# EAGLE schematic DIDV_Full (EAGLE 6.2)

## Sheet 1 of 4
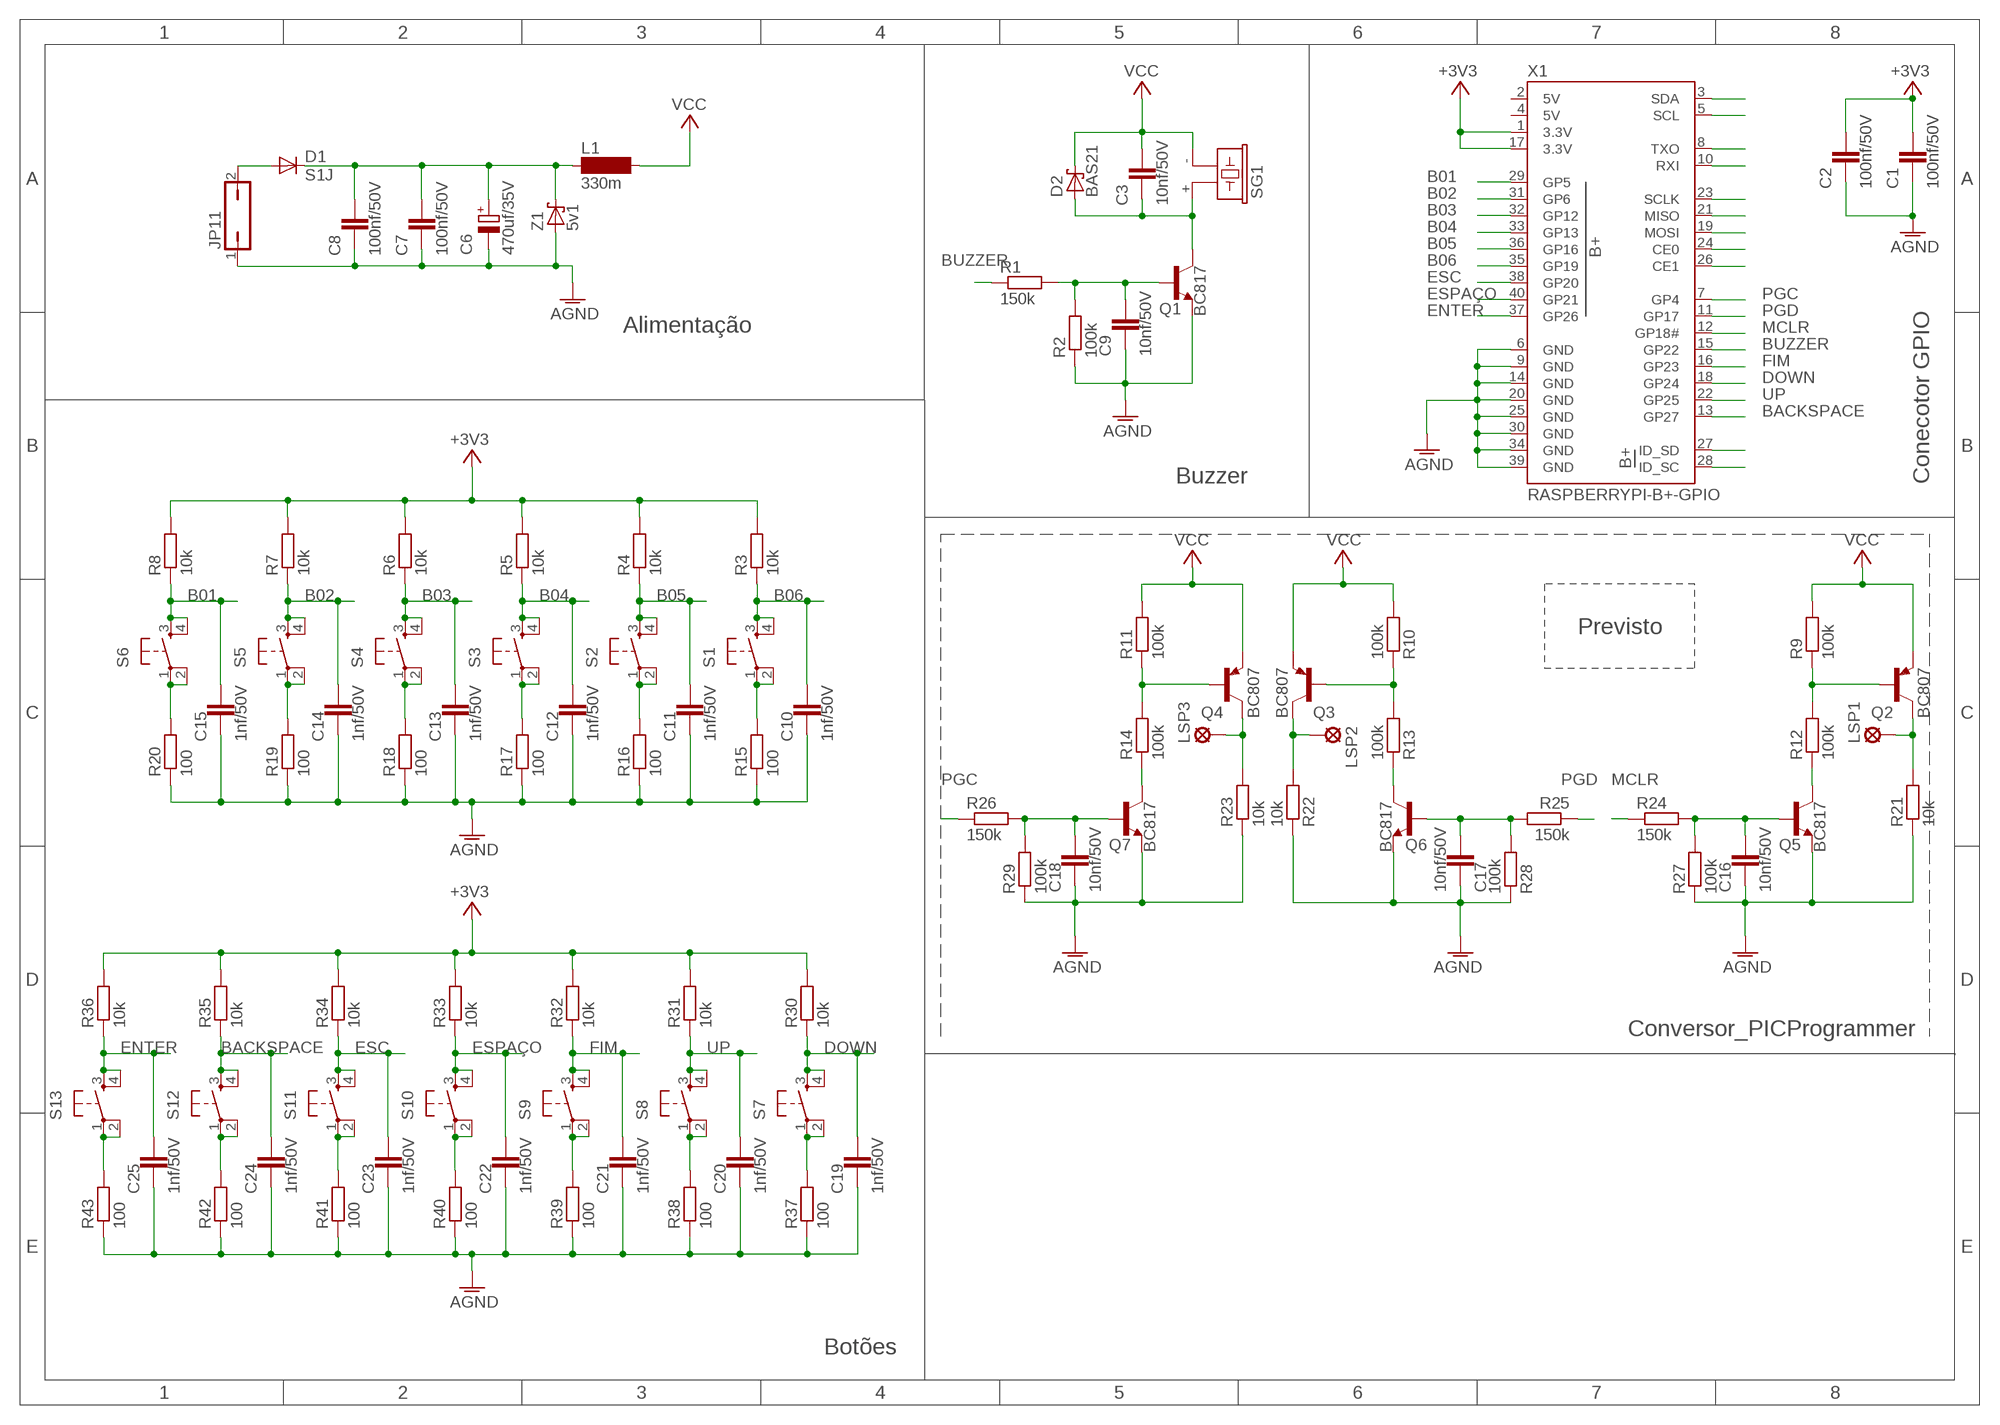
[diagram p0: schematic, sheet 1]

### Parts
C1  100nf/50V  C-EUC0603K  [C0603K]
C2  100nf/50V  C-EUC0603K  [C0603K]
C3  10nf/50V  C-EUC0603K  [C0603K]
C6  470uf/35V  CPOL-EU140CLH-1014  [140CLH-1014]
C7  100nf/50V  C-EUC0805  [C0805]
C8  100nf/50V  C-EUC0805  [C0805]
C9  10nf/50V  C-EUC0603K  [C0603K]
C10  1nf/50V  C-EUC0603K  [C0603K]
C11  1nf/50V  C-EUC0603K  [C0603K]
C12  1nf/50V  C-EUC0603K  [C0603K]
C13  1nf/50V  C-EUC0603K  [C0603K]
C14  1nf/50V  C-EUC0603K  [C0603K]
C15  1nf/50V  C-EUC0603K  [C0603K]
C16  10nf/50V  C-EUC0603K  [C0603K]
C17  10nf/50V  C-EUC0603K  [C0603K]
C18  10nf/50V  C-EUC0603K  [C0603K]
C19  1nf/50V  C-EUC0603K  [C0603K]
C20  1nf/50V  C-EUC0603K  [C0603K]
C21  1nf/50V  C-EUC0603K  [C0603K]
C22  1nf/50V  C-EUC0603K  [C0603K]
C23  1nf/50V  C-EUC0603K  [C0603K]
C24  1nf/50V  C-EUC0603K  [C0603K]
C25  1nf/50V  C-EUC0603K  [C0603K]
D1  S1J  DIODE-SMC  [SMC]
D2  BAS21  BAS40  [SOT23]
JP11  JP1Q  [JP1]
L1  330m  MS50  [MS50]
LSP1  LSP10  [LSP10]
LSP2  LSP10  [LSP10]
LSP3  LSP10  [LSP10]
Q1  BC817  BC817-16LT1SMD  [SOT23-BEC]
Q2  BC807  BC807-40SMD  [SOT23-BEC]
Q3  BC807  BC807-40SMD  [SOT23-BEC]
Q4  BC807  BC807-40SMD  [SOT23-BEC]
Q5  BC817  BC817-16LT1SMD  [SOT23-BEC]
Q6  BC817  BC817-16LT1SMD  [SOT23-BEC]
Q7  BC817  BC817-16LT1SMD  [SOT23-BEC]
R1  150k  R-EU_R0603  [R0603]
R2  100k  R-EU_R0603  [R0603]
R3  10k  R-EU_R0603  [R0603]
R4  10k  R-EU_R0603  [R0603]
R5  10k  R-EU_R0603  [R0603]
R6  10k  R-EU_R0603  [R0603]
R7  10k  R-EU_R0603  [R0603]
R8  10k  R-EU_R0603  [R0603]
R9  100k  R-EU_R0603  [R0603]
R10  100k  R-EU_R0603  [R0603]
R11  100k  R-EU_R0603  [R0603]
R12  100k  R-EU_R0603  [R0603]
R13  100k  R-EU_R0603  [R0603]
R14  100k  R-EU_R0603  [R0603]
R15  100  R-EU_R0603  [R0603]
R16  100  R-EU_R0603  [R0603]
R17  100  R-EU_R0603  [R0603]
R18  100  R-EU_R0603  [R0603]
R19  100  R-EU_R0603  [R0603]
R20  100  R-EU_R0603  [R0603]
R21  10k  R-EU_R0603  [R0603]
R22  10k  R-EU_R0603  [R0603]
R23  10k  R-EU_R0603  [R0603]
R24  150k  R-EU_R0603  [R0603]
R25  150k  R-EU_R0603  [R0603]
R26  150k  R-EU_R0603  [R0603]
R27  100k  R-EU_R0603  [R0603]
R28  100k  R-EU_R0603  [R0603]
R29  100k  R-EU_R0603  [R0603]
R30  10k  R-EU_R0603  [R0603]
R31  10k  R-EU_R0603  [R0603]
R32  10k  R-EU_R0603  [R0603]
R33  10k  R-EU_R0603  [R0603]
R34  10k  R-EU_R0603  [R0603]
R35  10k  R-EU_R0603  [R0603]
R36  10k  R-EU_R0603  [R0603]
R37  100  R-EU_R0603  [R0603]
R38  100  R-EU_R0603  [R0603]
R39  100  R-EU_R0603  [R0603]
R40  100  R-EU_R0603  [R0603]
R41  100  R-EU_R0603  [R0603]
R42  100  R-EU_R0603  [R0603]
R43  100  R-EU_R0603  [R0603]
S1  TAC_SWITCHSMD  [TACTILE-SWITCH-SMD]
S2  TAC_SWITCHSMD  [TACTILE-SWITCH-SMD]
S3  TAC_SWITCHSMD  [TACTILE-SWITCH-SMD]
S4  TAC_SWITCHSMD  [TACTILE-SWITCH-SMD]
S5  TAC_SWITCHSMD  [TACTILE-SWITCH-SMD]
S6  TAC_SWITCHSMD  [TACTILE-SWITCH-SMD]
S7  TAC_SWITCHSMD  [TACTILE-SWITCH-SMD]
S8  TAC_SWITCHSMD  [TACTILE-SWITCH-SMD]
S9  TAC_SWITCHSMD  [TACTILE-SWITCH-SMD]
S10  TAC_SWITCHSMD  [TACTILE-SWITCH-SMD]
S11  TAC_SWITCHSMD  [TACTILE-SWITCH-SMD]
S12  TAC_SWITCHSMD  [TACTILE-SWITCH-SMD]
S13  TAC_SWITCHSMD  [TACTILE-SWITCH-SMD]
SG1  F/CM12P  [F/CM12P]
X1  RASPBERRYPI-B+-GPIO  [2X20-SHROUDED]
Z1  5v1  BAS70  [SOT23]

### Nets
+3V3: C1.1 C2.1 R3.2 R4.2 R5.2 R6.2 R7.2 R8.2 R30.2 R31.2 R32.2 R33.2 R34.2 R35.2 R36.2 X1.1(3.3V) X1.17(3.3V)
AGND: C1.2 C2.2 C6.- C7.2 C8.2 C9.2 C10.2 C11.2 C12.2 C13.2 C14.2 C15.2 C16.2 C17.2 C18.2 C19.2 C20.2 C21.2 C22.2 C23.2 C24.2 C25.2 JP11.1 Q1.E Q5.E Q6.E Q7.E R2.1 R15.1 R16.1 R17.1 R18.1 R19.1 R20.1 R21.1 R22.1 R23.1 R27.1 R28.1 R29.1 R37.1 R38.1 R39.1 R40.1 R41.1 R42.1 R43.1 X1.6(GND) X1.9(GND) X1.14(GND) X1.20(GND) X1.25(GND) X1.30(GND) X1.34(GND) X1.39(GND) Z1.1(A) ; also sheet 2,3,4
B01: C15.1 R8.1 S6.3 S6.4 X1.29(GP5)
B02: C14.1 R7.1 S5.3 S5.4 X1.31(GP6)
B03: C13.1 R6.1 S4.3 S4.4 X1.32(GP12)
B04: C12.1 R5.1 S3.3 S3.4 X1.33(GP13)
B05: C11.1 R4.1 S2.3 S2.4 X1.36(GP16)
B06: C10.1 R3.1 S1.3 S1.4 X1.35(GP19)
BACKSPACE: C24.1 R35.1 S12.3 S12.4 X1.13(GP27)
BUZZER: R1.1 X1.15(GP22)
DOWN: C19.1 R30.1 S7.3 S7.4 X1.18(GP24)
ENTER: C25.1 R36.1 S13.3 S13.4 X1.37(GP26)
ESC: C23.1 R34.1 S11.3 S11.4 X1.38(GP20)
ESPAÇO: C22.1 R33.1 S10.3 S10.4 X1.40(GP21)
FIM: C21.1 R32.1 S9.3 S9.4 X1.16(GP23)
MCLR: R24.1 X1.12(GP18#) ; also sheet 3
N$76: D1.A JP11.2
N$77: C6.+ C7.1 C8.1 D1.C L1.1 Z1.3(C)
N$78: R20.2 S6.1 S6.2
N$79: R15.2 S1.1 S1.2
N$80: R16.2 S2.1 S2.2
N$81: R17.2 S3.1 S3.2
N$82: R18.2 S4.1 S4.2
N$83: R19.2 S5.1 S5.2
N$84: R43.2 S13.1 S13.2
N$86: R38.2 S8.1 S8.2
N$87: R39.2 S9.1 S9.2
N$88: R40.2 S10.1 S10.2
N$89: R41.2 S11.1 S11.2
N$90: R42.2 S12.1 S12.2
N$91: R37.2 S7.1 S7.2
N$92: C3.2 D2.1(A) Q1.C SG1.+
N$93: C9.1 Q1.B R1.2 R2.2
N$94: X1.28(ID_SC)
N$95: X1.27(ID_SD)
N$96: X1.26(CE1)
N$97: X1.24(CE0)
N$98: X1.19(MOSI)
N$99: X1.21(MISO)
N$100: X1.23(SCLK)
N$101: X1.10(RXI)
N$102: X1.8(TXO)
N$103: X1.5(SCL)
N$104: X1.3(SDA)
N$105: Q7.C R14.1
N$106: C18.1 Q7.B R26.2 R29.2
N$107: Q4.B R11.1 R14.2
N$108: LSP3.MP Q4.C R23.2
N$117: Q6.C R13.1
N$119: C17.1 Q6.B R25.2 R28.2
N$120: Q3.B R10.1 R13.2
N$121: LSP2.MP Q3.C R22.2
N$122: Q5.C R12.1
N$123: C16.1 Q5.B R24.2 R27.2
N$124: Q2.B R9.1 R12.2
N$125: LSP1.MP Q2.C R21.2
PGC: R26.1 X1.7(GP4) ; also sheet 3
PGD: R25.1 X1.11(GP17) ; also sheet 3
UP: C20.1 R31.1 S8.3 S8.4 X1.22(GP25)
VCC: C3.1 D2.3(C) L1.2 Q2.E Q3.E Q4.E R9.2 R10.2 R11.2 SG1.- ; also sheet 2,3,4

### Notes on the sheet
- Alimentação
- Buzzer | Conecotor GPIO
- Previsto
- Conversor_PICProgrammer
- Botões

## Sheet 2 of 4
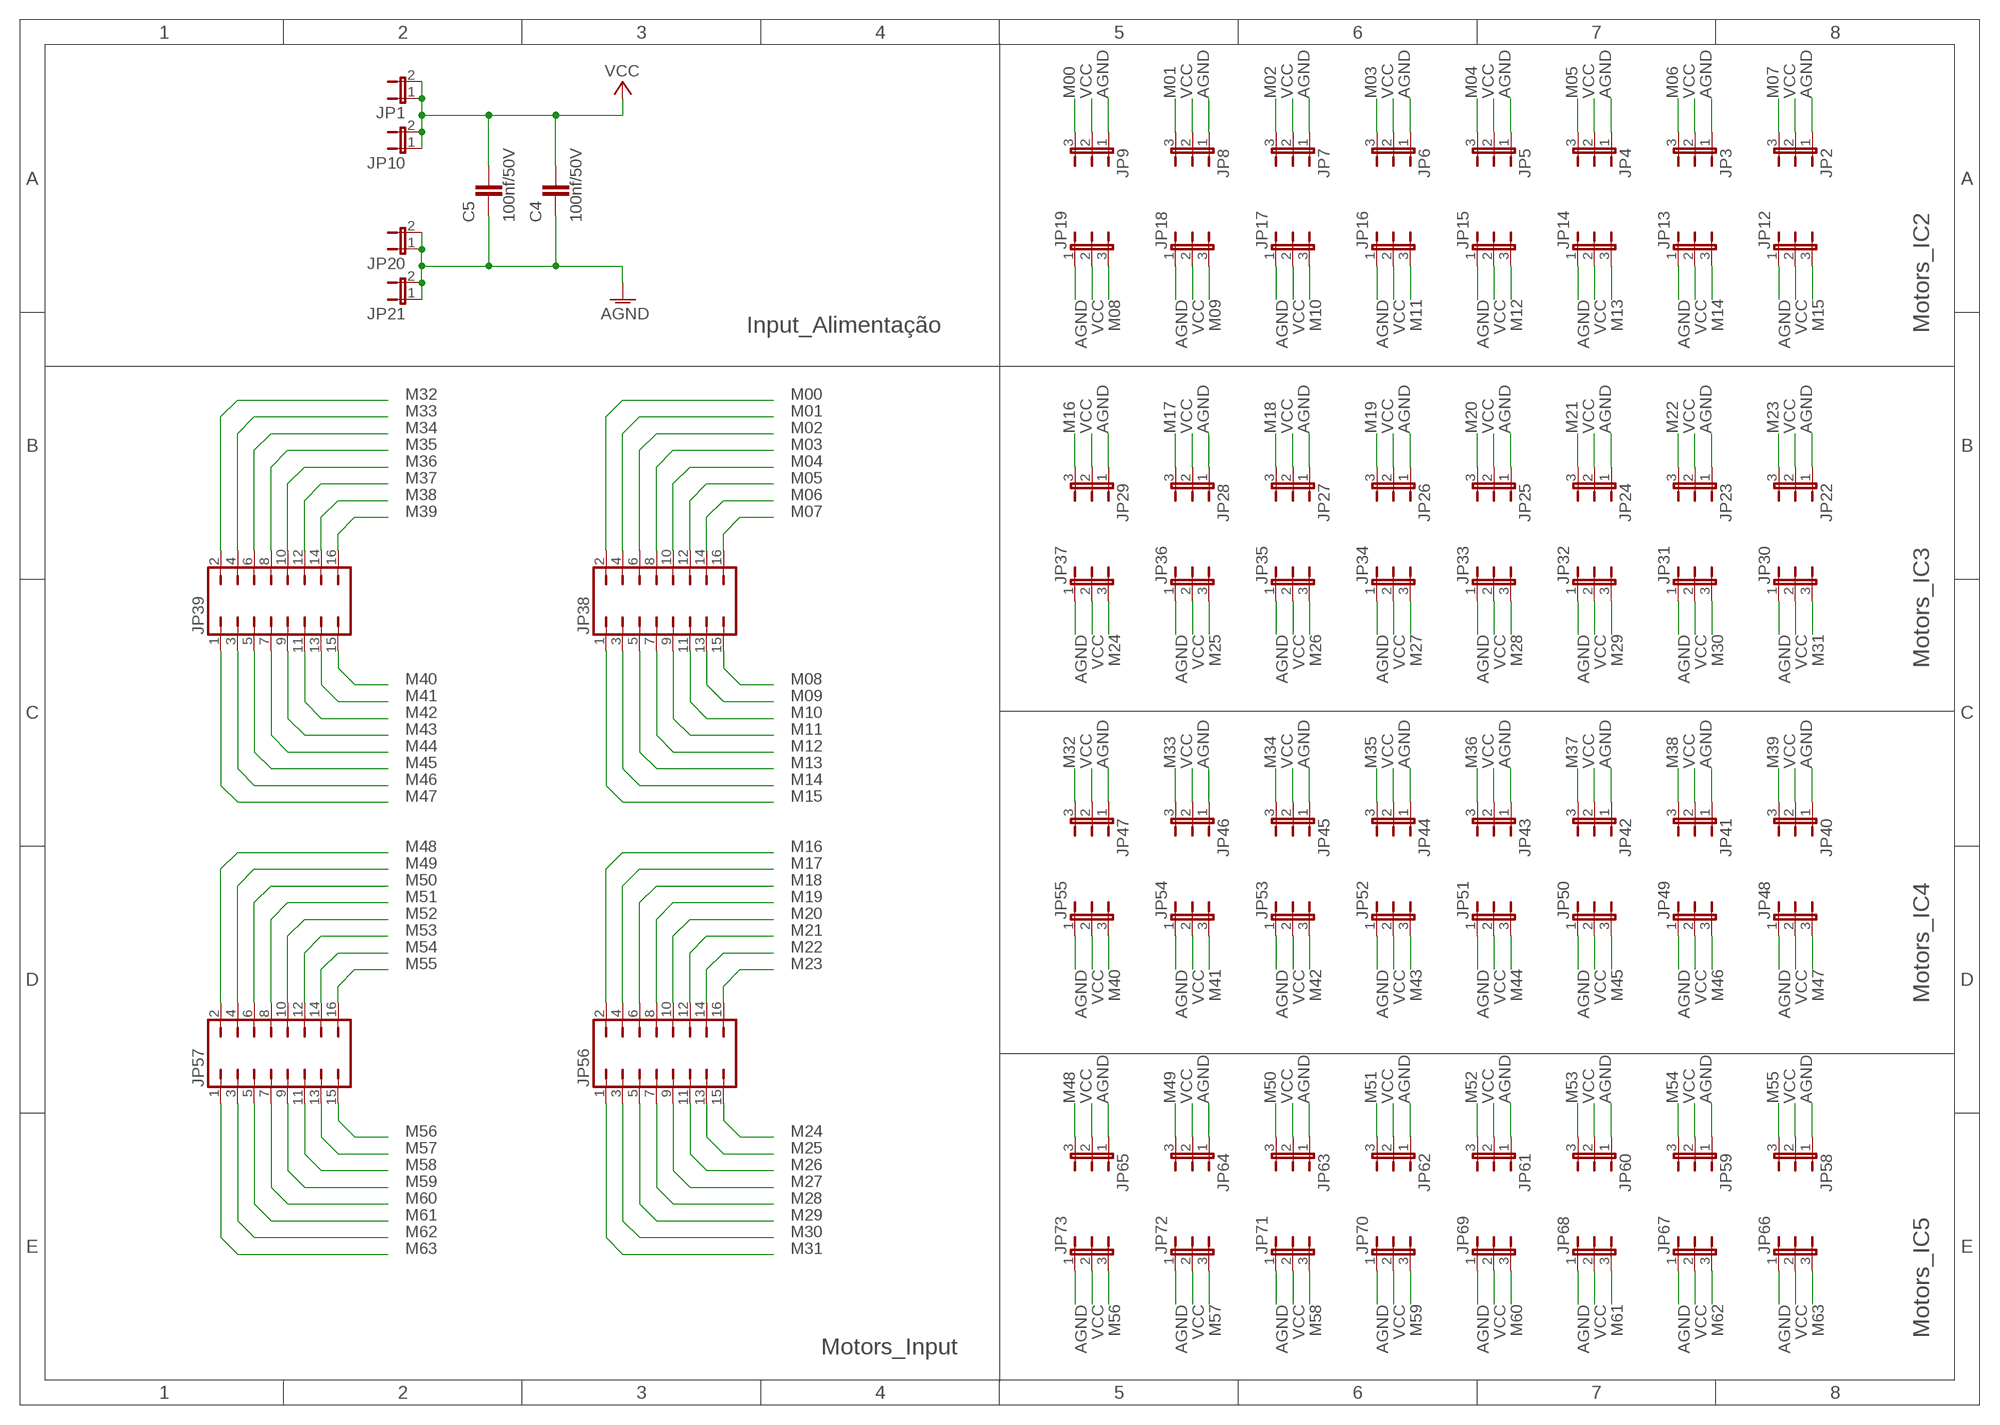
[diagram p1: schematic, sheet 2]

### Parts
C4  100nf/50V  C-EUC0805K  [C0805K]
C5  100nf/50V  C-EUC0805K  [C0805K]
JP1  JP1E  [JP1]
JP2  JP2E  [JP2]
JP3  JP2E  [JP2]
JP4  JP2E  [JP2]
JP5  JP2E  [JP2]
JP6  JP2E  [JP2]
JP7  JP2E  [JP2]
JP8  JP2E  [JP2]
JP9  JP2E  [JP2]
JP10  JP1E  [JP1]
JP12  JP2E  [JP2]
JP13  JP2E  [JP2]
JP14  JP2E  [JP2]
JP15  JP2E  [JP2]
JP16  JP2E  [JP2]
JP17  JP2E  [JP2]
JP18  JP2E  [JP2]
JP19  JP2E  [JP2]
JP20  JP1E  [JP1]
JP21  JP1E  [JP1]
JP22  JP2E  [JP2]
JP23  JP2E  [JP2]
JP24  JP2E  [JP2]
JP25  JP2E  [JP2]
JP26  JP2E  [JP2]
JP27  JP2E  [JP2]
JP28  JP2E  [JP2]
JP29  JP2E  [JP2]
JP30  JP2E  [JP2]
JP31  JP2E  [JP2]
JP32  JP2E  [JP2]
JP33  JP2E  [JP2]
JP34  JP2E  [JP2]
JP35  JP2E  [JP2]
JP36  JP2E  [JP2]
JP37  JP2E  [JP2]
JP38  JP8Q  [JP8Q]
JP39  JP8Q  [JP8Q]
JP40  JP2E  [JP2]
JP41  JP2E  [JP2]
JP42  JP2E  [JP2]
JP43  JP2E  [JP2]
JP44  JP2E  [JP2]
JP45  JP2E  [JP2]
JP46  JP2E  [JP2]
JP47  JP2E  [JP2]
JP48  JP2E  [JP2]
JP49  JP2E  [JP2]
JP50  JP2E  [JP2]
JP51  JP2E  [JP2]
JP52  JP2E  [JP2]
JP53  JP2E  [JP2]
JP54  JP2E  [JP2]
JP55  JP2E  [JP2]
JP56  JP8Q  [JP8Q]
JP57  JP8Q  [JP8Q]
JP58  JP2E  [JP2]
JP59  JP2E  [JP2]
JP60  JP2E  [JP2]
JP61  JP2E  [JP2]
JP62  JP2E  [JP2]
JP63  JP2E  [JP2]
JP64  JP2E  [JP2]
JP65  JP2E  [JP2]
JP66  JP2E  [JP2]
JP67  JP2E  [JP2]
JP68  JP2E  [JP2]
JP69  JP2E  [JP2]
JP70  JP2E  [JP2]
JP71  JP2E  [JP2]
JP72  JP2E  [JP2]
JP73  JP2E  [JP2]

### Nets
AGND: C4.2 C5.2 JP2.1 JP3.1 JP4.1 JP5.1 JP6.1 JP7.1 JP8.1 JP9.1 JP12.1 JP13.1 JP14.1 JP15.1 JP16.1 JP17.1 JP18.1 JP19.1 JP20.1 JP20.2 JP21.1 JP21.2 JP22.1 JP23.1 JP24.1 JP25.1 JP26.1 JP27.1 JP28.1 JP29.1 JP30.1 JP31.1 JP32.1 JP33.1 JP34.1 JP35.1 JP36.1 JP37.1 JP40.1 JP41.1 JP42.1 JP43.1 JP44.1 JP45.1 JP46.1 JP47.1 JP48.1 JP49.1 JP50.1 JP51.1 JP52.1 JP53.1 JP54.1 JP55.1 JP58.1 JP59.1 JP60.1 JP61.1 JP62.1 JP63.1 JP64.1 JP65.1 JP66.1 JP67.1 JP68.1 JP69.1 JP70.1 JP71.1 JP72.1 JP73.1 ; also sheet 1,3,4
M00: JP9.3 JP38.2 ; also sheet 3
M01: JP8.3 JP38.4 ; also sheet 3
M02: JP7.3 JP38.6 ; also sheet 3
M03: JP6.3 JP38.8 ; also sheet 3
M04: JP5.3 JP38.10 ; also sheet 3
M05: JP4.3 JP38.12 ; also sheet 3
M06: JP3.3 JP38.14 ; also sheet 3
M07: JP2.3 JP38.16 ; also sheet 3
M08: JP19.3 JP38.15 ; also sheet 3
M09: JP18.3 JP38.13 ; also sheet 3
M10: JP17.3 JP38.11 ; also sheet 3
M11: JP16.3 JP38.9 ; also sheet 3
M12: JP15.3 JP38.7 ; also sheet 3
M13: JP14.3 JP38.5 ; also sheet 3
M14: JP13.3 JP38.3 ; also sheet 3
M15: JP12.3 JP38.1 ; also sheet 3
M16: JP29.3 JP56.2 ; also sheet 3
M17: JP28.3 JP56.4 ; also sheet 3
M18: JP27.3 JP56.6 ; also sheet 3
M19: JP26.3 JP56.8 ; also sheet 3
M20: JP25.3 JP56.10 ; also sheet 3
M21: JP24.3 JP56.12 ; also sheet 3
M22: JP23.3 JP56.14 ; also sheet 3
M23: JP22.3 JP56.16 ; also sheet 3
M24: JP37.3 JP56.15 ; also sheet 3
M25: JP36.3 JP56.13 ; also sheet 3
M26: JP35.3 JP56.11 ; also sheet 3
M27: JP34.3 JP56.9 ; also sheet 3
M28: JP33.3 JP56.7 ; also sheet 3
M29: JP32.3 JP56.5 ; also sheet 3
M30: JP31.3 JP56.3 ; also sheet 3
M31: JP30.3 JP56.1 ; also sheet 3
M32: JP39.2 JP47.3 ; also sheet 3
M33: JP39.4 JP46.3 ; also sheet 3
M34: JP39.6 JP45.3 ; also sheet 3
M35: JP39.8 JP44.3 ; also sheet 3
M36: JP39.10 JP43.3 ; also sheet 3
M37: JP39.12 JP42.3 ; also sheet 3
M38: JP39.14 JP41.3 ; also sheet 3
M39: JP39.16 JP40.3 ; also sheet 3
M40: JP39.15 JP55.3 ; also sheet 3
M41: JP39.13 JP54.3 ; also sheet 3
M42: JP39.11 JP53.3 ; also sheet 3
M43: JP39.9 JP52.3 ; also sheet 3
M44: JP39.7 JP51.3 ; also sheet 3
M45: JP39.5 JP50.3 ; also sheet 3
M46: JP39.3 JP49.3 ; also sheet 3
M47: JP39.1 JP48.3 ; also sheet 3
M48: JP57.2 JP65.3 ; also sheet 3
M49: JP57.4 JP64.3 ; also sheet 3
M50: JP57.6 JP63.3 ; also sheet 3
M51: JP57.8 JP62.3 ; also sheet 3
M52: JP57.10 JP61.3 ; also sheet 3
M53: JP57.12 JP60.3 ; also sheet 3
M54: JP57.14 JP59.3 ; also sheet 3
M55: JP57.16 JP58.3 ; also sheet 3
M56: JP57.15 JP73.3 ; also sheet 3
M57: JP57.13 JP72.3 ; also sheet 3
M58: JP57.11 JP71.3 ; also sheet 3
M59: JP57.9 JP70.3 ; also sheet 3
M60: JP57.7 JP69.3 ; also sheet 3
M61: JP57.5 JP68.3 ; also sheet 3
M62: JP57.3 JP67.3 ; also sheet 3
M63: JP57.1 JP66.3 ; also sheet 3
VCC: C4.1 C5.1 JP1.1 JP1.2 JP2.2 JP3.2 JP4.2 JP5.2 JP6.2 JP7.2 JP8.2 JP9.2 JP10.1 JP10.2 JP12.2 JP13.2 JP14.2 JP15.2 JP16.2 JP17.2 JP18.2 JP19.2 JP22.2 JP23.2 JP24.2 JP25.2 JP26.2 JP27.2 JP28.2 JP29.2 JP30.2 JP31.2 JP32.2 JP33.2 JP34.2 JP35.2 JP36.2 JP37.2 JP40.2 JP41.2 JP42.2 JP43.2 JP44.2 JP45.2 JP46.2 JP47.2 JP48.2 JP49.2 JP50.2 JP51.2 JP52.2 JP53.2 JP54.2 JP55.2 JP58.2 JP59.2 JP60.2 JP61.2 JP62.2 JP63.2 JP64.2 JP65.2 JP66.2 JP67.2 JP68.2 JP69.2 JP70.2 JP71.2 JP72.2 JP73.2 ; also sheet 1,3,4

### Notes on the sheet
- Input_Alimentação
- Motors_IC2
- Motors_IC3
- Motors_IC4
- Motors_Input | Motors_IC5

## Sheet 3 of 4
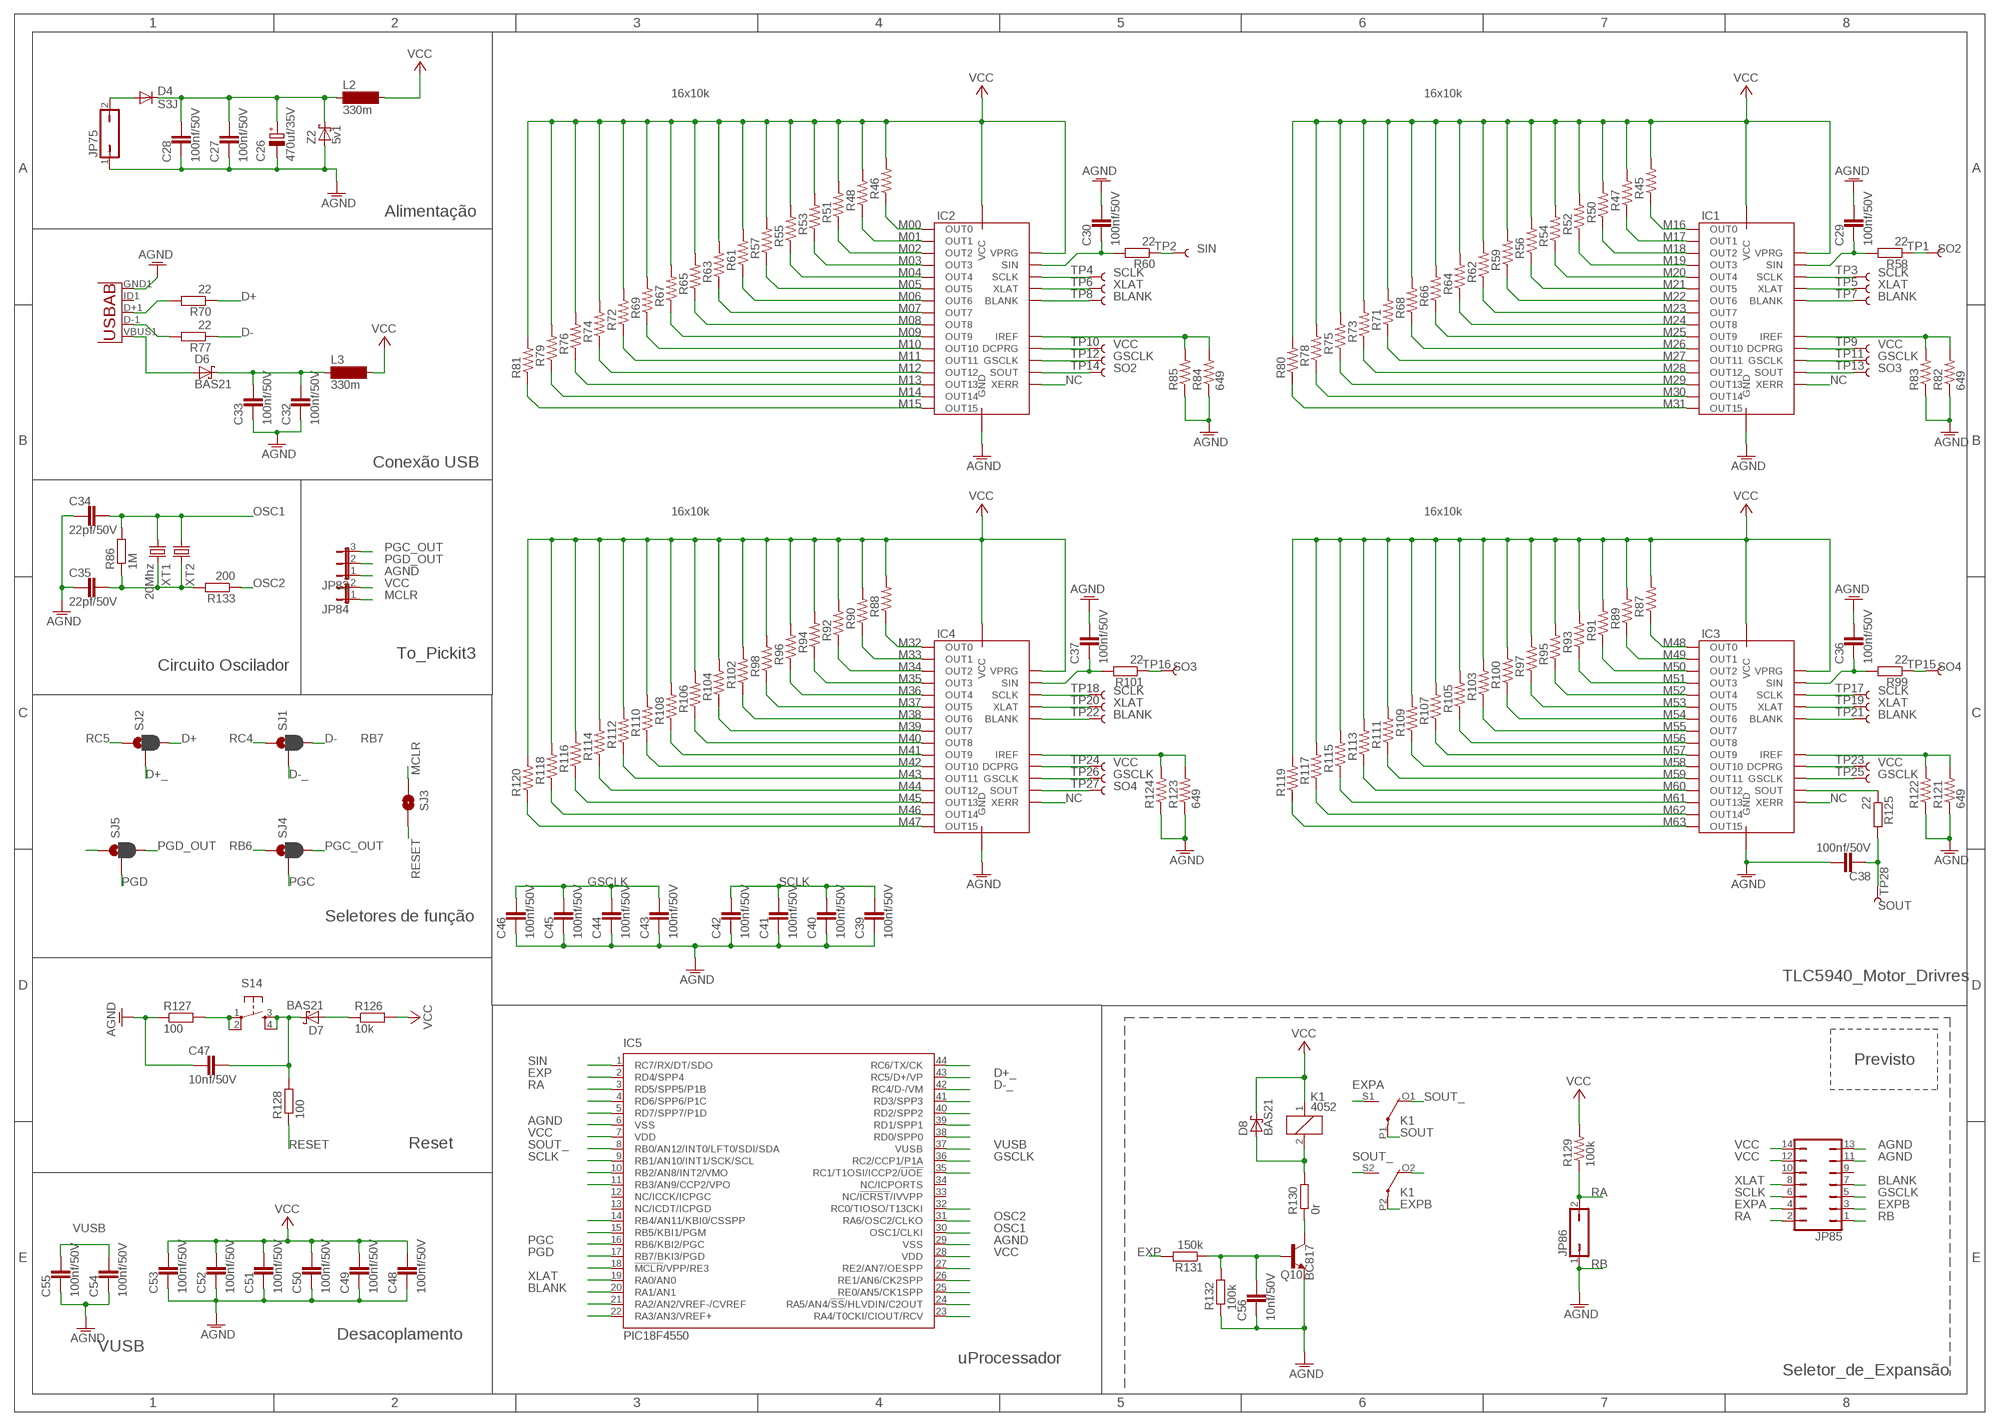
[diagram p2: schematic, sheet 3]

### Parts
C26  470uf/35V  CPOL-EU140CLH-1014  [140CLH-1014]
C27  100nf/50V  C-EUC0805  [C0805]
C28  100nf/50V  C-EUC0805  [C0805]
C29  100nf/50V  C-EUC0603K  [C0603K]
C30  100nf/50V  C-EUC0603K  [C0603K]
C32  100nf/50V  C-EUC0805  [C0805]
C33  100nf/50V  C-EUC0805  [C0805]
C34  22pf/50V  C-EUC0603K  [C0603K]
C35  22pf/50V  C-EUC0603K  [C0603K]
C36  100nf/50V  C-EUC0603K  [C0603K]
C37  100nf/50V  C-EUC0603K  [C0603K]
C38  100nf/50V  C-EUC0603K  [C0603K]
C39  100nf/50V  C-EUC0603K  [C0603K]
C40  100nf/50V  C-EUC0603K  [C0603K]
C41  100nf/50V  C-EUC0603K  [C0603K]
C42  100nf/50V  C-EUC0603K  [C0603K]
C43  100nf/50V  C-EUC0603K  [C0603K]
C44  100nf/50V  C-EUC0603K  [C0603K]
C45  100nf/50V  C-EUC0603K  [C0603K]
C46  100nf/50V  C-EUC0603K  [C0603K]
C47  10nf/50V  C-EUC0603K  [C0603K]
C48  100nf/50V  C-EUC0805  [C0805]
C49  100nf/50V  C-EUC0805  [C0805]
C50  100nf/50V  C-EUC0805  [C0805]
C51  100nf/50V  C-EUC0805  [C0805]
C52  100nf/50V  C-EUC0805  [C0805]
C53  100nf/50V  C-EUC0805  [C0805]
C54  100nf/50V  C-EUC0805  [C0805]
C55  100nf/50V  C-EUC0805  [C0805]
C56  10nf/50V  C-EUC0603K  [C0603K]
D4  S3J  DIODE-SMC  [SMC]
D6  BAS21  BAS40  [SOT23]
D7  BAS21  BAS40  [SOT23]
D8  BAS21  BAS40  [SOT23]
IC1  IC-PACKAGE_DIL28-3  [IC-PACKAGE_DIL28-3]
IC2  IC-PACKAGE_DIL28-3  [IC-PACKAGE_DIL28-3]
IC3  IC-PACKAGE_DIL28-3  [IC-PACKAGE_DIL28-3]
IC4  IC-PACKAGE_DIL28-3  [IC-PACKAGE_DIL28-3]
IC5  PIC18F4550  PIC18F4550_TQFP  [TQFP44]
JP75  JP1Q  [JP1]
JP83  JP2E  [JP2]
JP84  JP1E  [JP1]
JP85  JP7Q  [JP7Q]
JP86  JP1Q  [JP1]
K1  4052  [F4052]
L2  330m  MS50  [MS50]
L3  330m  MS50  [MS50]
Q10  BC817  BC817-16LT1SMD  [SOT23-BEC]
R45  R-US_R0805  [R0805]
R46  R-US_R0805  [R0805]
R47  R-US_R0805  [R0805]
R48  R-US_R0805  [R0805]
R50  R-US_R0805  [R0805]
R51  R-US_R0805  [R0805]
R52  R-US_R0805  [R0805]
R53  R-US_R0805  [R0805]
R54  R-US_R0805  [R0805]
R55  R-US_R0805  [R0805]
R56  R-US_R0805  [R0805]
R57  R-US_R0805  [R0805]
R58  22  R-EU_R0603  [R0603]
R59  R-US_R0805  [R0805]
R60  22  R-EU_R0603  [R0603]
R61  R-US_R0805  [R0805]
R62  R-US_R0805  [R0805]
R63  R-US_R0805  [R0805]
R64  R-US_R0805  [R0805]
R65  R-US_R0805  [R0805]
R66  R-US_R0805  [R0805]
R67  R-US_R0805  [R0805]
R68  R-US_R0805  [R0805]
R69  R-US_R0805  [R0805]
R70  22  R-EU_R0603  [R0603]
R71  R-US_R0805  [R0805]
R72  R-US_R0805  [R0805]
R73  R-US_R0805  [R0805]
R74  R-US_R0805  [R0805]
R75  R-US_R0805  [R0805]
R76  R-US_R0805  [R0805]
R77  22  R-EU_R0603  [R0603]
R78  R-US_R0805  [R0805]
R79  R-US_R0805  [R0805]
R80  R-US_R0805  [R0805]
R81  R-US_R0805  [R0805]
R82  649  R-US_R0805  [R0805]
R83  R-US_R0805  [R0805]
R84  649  R-US_R0805  [R0805]
R85  R-US_R0805  [R0805]
R86  1M  R-EU_R0603  [R0603]
R87  R-US_R0805  [R0805]
R88  R-US_R0805  [R0805]
R89  R-US_R0805  [R0805]
R90  R-US_R0805  [R0805]
R91  R-US_R0805  [R0805]
R92  R-US_R0805  [R0805]
R93  R-US_R0805  [R0805]
R94  R-US_R0805  [R0805]
R95  R-US_R0805  [R0805]
R96  R-US_R0805  [R0805]
R97  R-US_R0805  [R0805]
R98  R-US_R0805  [R0805]
R99  22  R-EU_R0603  [R0603]
R100  R-US_R0805  [R0805]
R101  22  R-EU_R0603  [R0603]
R102  R-US_R0805  [R0805]
R103  R-US_R0805  [R0805]
R104  R-US_R0805  [R0805]
R105  R-US_R0805  [R0805]
R106  R-US_R0805  [R0805]
R107  R-US_R0805  [R0805]
R108  R-US_R0805  [R0805]
R109  R-US_R0805  [R0805]
R110  R-US_R0805  [R0805]
R111  R-US_R0805  [R0805]
R112  R-US_R0805  [R0805]
R113  R-US_R0805  [R0805]
R114  R-US_R0805  [R0805]
R115  R-US_R0805  [R0805]
R116  R-US_R0805  [R0805]
R117  R-US_R0805  [R0805]
R118  R-US_R0805  [R0805]
R119  R-US_R0805  [R0805]
R120  R-US_R0805  [R0805]
R121  649  R-US_R0805  [R0805]
R122  R-US_R0805  [R0805]
R123  649  R-US_R0805  [R0805]
R124  R-US_R0805  [R0805]
R125  22  R-EU_R0603  [R0603]
R126  10k  R-EU_R0603  [R0603]
R127  100  R-EU_R0603  [R0603]
R128  100  R-EU_R0603  [R0603]
R129  100k  R-US_R0805  [R0805]
R130  0r  R-EU_R0603  [R0603]
R131  150k  R-EU_R0603  [R0603]
R132  100k  R-EU_R0603  [R0603]
R133  200  R-EU_R0603  [R0603]
S14  TAC_SWITCHSMD  [TACTILE-SWITCH-SMD]
SJ1  JUMPER-PAD-3-2OF3_NC_BY_PASTE  [PAD-JUMPER-3-2OF3_NC_BY_PASTE_YES_SILK_FULL_BOX]
SJ2  JUMPER-PAD-3-2OF3_NC_BY_PASTE  [PAD-JUMPER-3-2OF3_NC_BY_PASTE_YES_SILK_FULL_BOX]
SJ3  JUMPER-PAD-2-NOYES_SILK  [PAD-JUMPER-2-NO_YES_SILK]
SJ4  JUMPER-PAD-3-2OF3_NC_BY_PASTE  [PAD-JUMPER-3-2OF3_NC_BY_PASTE_YES_SILK_FULL_BOX]
SJ5  JUMPER-PAD-3-2OF3_NC_BY_PASTE  [PAD-JUMPER-3-2OF3_NC_BY_PASTE_YES_SILK_FULL_BOX]
TP1  TEST-POINT3X4  [PAD.03X.04]
TP2  TEST-POINT3X4  [PAD.03X.04]
TP3  TEST-POINT3X4  [PAD.03X.04]
TP4  TEST-POINT3X4  [PAD.03X.04]
TP5  TEST-POINT3X4  [PAD.03X.04]
TP6  TEST-POINT3X4  [PAD.03X.04]
TP7  TEST-POINT3X4  [PAD.03X.04]
TP8  TEST-POINT3X4  [PAD.03X.04]
TP9  TEST-POINT3X4  [PAD.03X.04]
TP10  TEST-POINT3X4  [PAD.03X.04]
TP11  TEST-POINT3X4  [PAD.03X.04]
TP12  TEST-POINT3X4  [PAD.03X.04]
TP13  TEST-POINT3X4  [PAD.03X.04]
TP14  TEST-POINT3X4  [PAD.03X.04]
TP15  TEST-POINT3X4  [PAD.03X.04]
TP16  TEST-POINT3X4  [PAD.03X.04]
TP17  TEST-POINT3X4  [PAD.03X.04]
TP18  TEST-POINT3X4  [PAD.03X.04]
TP19  TEST-POINT3X4  [PAD.03X.04]
TP20  TEST-POINT3X4  [PAD.03X.04]
TP21  TEST-POINT3X4  [PAD.03X.04]
TP22  TEST-POINT3X4  [PAD.03X.04]
TP23  TEST-POINT3X4  [PAD.03X.04]
TP24  TEST-POINT3X4  [PAD.03X.04]
TP25  TEST-POINT3X4  [PAD.03X.04]
TP26  TEST-POINT3X4  [PAD.03X.04]
TP27  TEST-POINT3X4  [PAD.03X.04]
TP28  TEST-POINT3X4  [PAD.03X.04]
U1  USB-ABCONN-11794  [USB-AB-MICRO-SMD_V03]
XT1  20Mhz  CRYSTALHC49UP  [HC49UP]
XT2  CRYSTALHC49U-V  [HC49U-V]
Z2  5v1  BAS70  [SOT23]

### Nets
AGND: C26.- C27.2 C28.2 C29.1 C30.1 C32.2 C33.2 C34.2 C35.2 C36.1 C37.1 C38.1 C39.2 C40.2 C41.2 C42.2 C43.2 C44.2 C45.2 C46.2 C47.2 C48.2 C49.2 C50.2 C51.2 C52.2 C53.2 C54.2 C55.2 C56.2 IC1.22(GND) IC2.22(GND) IC3.22(GND) IC4.22(GND) IC5.6(VSS) IC5.29(VSS) JP75.1 JP83.1 JP85.11 JP85.13 Q10.E R82.1 R83.1 R84.1 R85.1 R121.1 R122.1 R123.1 R124.1 R127.1 R132.1 U1.GND1(GND) Z2.1(A) ; also sheet 1,2,4
BLANK: IC1.23(BLANK) IC2.23(BLANK) IC3.23(BLANK) IC4.23(BLANK) IC5.20(RA1/AN1) JP85.7 TP7.P$1 TP8.P$1 TP21.P$1 TP22.P$1
D+: R70.1 SJ2.3
D+_: IC5.43(RC5/D+/VP) SJ2.2
D-: R77.1 SJ1.3
D-_: IC5.42(RC4/D-/VM) SJ1.2
EXP: IC5.2(RD4/SPP4) R131.2
EXPA: JP85.4 K1.S1(2:S)
EXPB: JP85.3 K1.P2(3:P)
GSCLK: C43.1 C44.1 C45.1 C46.1 IC1.18(GSCLK) IC2.18(GSCLK) IC3.18(GSCLK) IC4.18(GSCLK) IC5.36(RC2/CCP1/P1A) JP85.5 TP11.P$1 TP12.P$1 TP25.P$1 TP26.P$1
M00: IC2.28(OUT0) R46.1 ; also sheet 2
M01: IC2.1(OUT1) R48.1 ; also sheet 2
M02: IC2.2(OUT2) R51.1 ; also sheet 2
M03: IC2.3(OUT3) R53.1 ; also sheet 2
M04: IC2.4(OUT4) R55.1 ; also sheet 2
M05: IC2.5(OUT5) R57.1 ; also sheet 2
M06: IC2.6(OUT6) R61.1 ; also sheet 2
M07: IC2.7(OUT7) R63.1 ; also sheet 2
M08: IC2.8(OUT8) R65.1 ; also sheet 2
M09: IC2.9(OUT9) R67.1 ; also sheet 2
M10: IC2.10(OUT10) R69.1 ; also sheet 2
M11: IC2.11(OUT11) R72.1 ; also sheet 2
M12: IC2.12(OUT12) R74.1 ; also sheet 2
M13: IC2.13(OUT13) R76.1 ; also sheet 2
M14: IC2.14(OUT14) R79.1 ; also sheet 2
M15: IC2.15(OUT15) R81.1 ; also sheet 2
M16: IC1.28(OUT0) R45.1 ; also sheet 2
M17: IC1.1(OUT1) R47.1 ; also sheet 2
M18: IC1.2(OUT2) R50.1 ; also sheet 2
M19: IC1.3(OUT3) R52.1 ; also sheet 2
M20: IC1.4(OUT4) R54.1 ; also sheet 2
M21: IC1.5(OUT5) R56.1 ; also sheet 2
M22: IC1.6(OUT6) R59.1 ; also sheet 2
M23: IC1.7(OUT7) R62.1 ; also sheet 2
M24: IC1.8(OUT8) R64.1 ; also sheet 2
M25: IC1.9(OUT9) R66.1 ; also sheet 2
M26: IC1.10(OUT10) R68.1 ; also sheet 2
M27: IC1.11(OUT11) R71.1 ; also sheet 2
M28: IC1.12(OUT12) R73.1 ; also sheet 2
M29: IC1.13(OUT13) R75.1 ; also sheet 2
M30: IC1.14(OUT14) R78.1 ; also sheet 2
M31: IC1.15(OUT15) R80.1 ; also sheet 2
M32: IC4.28(OUT0) R88.1 ; also sheet 2
M33: IC4.1(OUT1) R90.1 ; also sheet 2
M34: IC4.2(OUT2) R92.1 ; also sheet 2
M35: IC4.3(OUT3) R94.1 ; also sheet 2
M36: IC4.4(OUT4) R96.1 ; also sheet 2
M37: IC4.5(OUT5) R98.1 ; also sheet 2
M38: IC4.6(OUT6) R102.1 ; also sheet 2
M39: IC4.7(OUT7) R104.1 ; also sheet 2
M40: IC4.8(OUT8) R106.1 ; also sheet 2
M41: IC4.9(OUT9) R108.1 ; also sheet 2
M42: IC4.10(OUT10) R110.1 ; also sheet 2
M43: IC4.11(OUT11) R112.1 ; also sheet 2
M44: IC4.12(OUT12) R114.1 ; also sheet 2
M45: IC4.13(OUT13) R116.1 ; also sheet 2
M46: IC4.14(OUT14) R118.1 ; also sheet 2
M47: IC4.15(OUT15) R120.1 ; also sheet 2
M48: IC3.28(OUT0) R87.1 ; also sheet 2
M49: IC3.1(OUT1) R89.1 ; also sheet 2
M50: IC3.2(OUT2) R91.1 ; also sheet 2
M51: IC3.3(OUT3) R93.1 ; also sheet 2
M52: IC3.4(OUT4) R95.1 ; also sheet 2
M53: IC3.5(OUT5) R97.1 ; also sheet 2
M54: IC3.6(OUT6) R100.1 ; also sheet 2
M55: IC3.7(OUT7) R103.1 ; also sheet 2
M56: IC3.8(OUT8) R105.1 ; also sheet 2
M57: IC3.9(OUT9) R107.1 ; also sheet 2
M58: IC3.10(OUT10) R109.1 ; also sheet 2
M59: IC3.11(OUT11) R111.1 ; also sheet 2
M60: IC3.12(OUT12) R113.1 ; also sheet 2
M61: IC3.13(OUT13) R115.1 ; also sheet 2
M62: IC3.14(OUT14) R117.1 ; also sheet 2
M63: IC3.15(OUT15) R119.1 ; also sheet 2
MCLR: JP84.1 SJ3.1 ; also sheet 1
N$126: IC5.27(RE2/AN7/OESPP)
N$127: IC5.26(RE1/AN6/CK2SPP)
N$128: IC5.25(RE0/AN5/CK1SPP)
N$129: IC5.24(RA5/AN4/!SS!/HLVDIN/C2OUT)
N$130: IC5.23(RA4/T0CKI/CIOUT/RCV)
N$131: IC5.14(RB4/AN11/KBI0/CSSPP)
N$132: IC5.15(RB5/KBI1/PGM)
N$133: IC5.22(RA3/AN3/VREF+)
N$134: R127.2 S14.1 S14.2
N$135: C47.1 D7.3(C) R128.2 S14.3 S14.4
N$136: D7.1(A) R126.1
N$137: D4.A JP75.2
N$138: C26.+ C27.1 C28.1 D4.C L2.1 Z2.3(C)
N$139: R70.2 U1.D+1(D+)
N$140: R77.2 U1.D-1(D-)
N$141: D6.1(A) U1.VBUS1(VBUS)
N$142: IC1.20(IREF) R82.2 R83.2
N$143: IC3.20(IREF) R121.2 R122.2
N$145: IC4.20(IREF) R123.2 R124.2
N$146: IC2.20(IREF) R84.2 R85.2
N$147: C32.1 C33.1 D6.3(C) L3.1
N$148: C30.2 IC2.26(SIN) R60.2
N$149: C29.2 IC1.26(SIN) R58.2
N$150: C37.2 IC4.26(SIN) R101.2
N$151: C36.2 IC3.26(SIN) R99.2
N$152: IC3.17(SOUT) R125.1
N$153: IC5.35(RC1/T1OSI/ICCP2/!UOE)
N$154: IC5.38(RD0/SPP0)
N$155: IC5.39(RD1/SPP1)
N$156: IC5.40(RD2/SPP2)
N$157: IC5.41(RD3/SPP3)
N$158: IC5.44(RC6/TX/CK)
N$159: IC5.32(RC0/TIOSO/T13CKI)
N$160: IC5.21(RA2/AN2/VREF-/CVREF)
N$161: IC5.18(!MCLR!/VPP/RE3)
N$162: IC5.10(RB2/AN8/INT2/VMO)
N$163: IC5.11(RB3/AN9/CCP2/VPO)
N$164: IC5.5(RD7/SPP7/P1D)
N$165: IC5.4(RD6/SPP6/P1C)
N$166: Q10.C R130.1
N$167: C56.1 Q10.B R131.1 R132.2
N$168: D8.1(A) K1.2 R130.2
N$169: K1.O2(3:O)
NC: IC1.16(XERR) IC2.16(XERR) IC3.16(XERR) IC4.16(XERR)
OSC1: C34.1 IC5.30(OSC1/CLKI) R86.2 XT1.1 XT2.1
OSC2: C35.1 IC5.31(RA6/OSC2/CLKO) R86.1 R133.1 R133.2 XT1.2 XT2.2
PGC: IC5.16(RB6/KBI2/PGC) SJ4.2 ; also sheet 1
PGC_OUT: JP83.3 SJ4.3
PGD: IC5.17(RB7/BKI3/PGD) SJ5.2 ; also sheet 1
PGD_OUT: JP83.2 SJ5.3
RA: IC5.3(RD5/SPP5/P1B) JP85.2 JP86.2 R129.1
RB: JP85.1 JP86.1 ; supply symbol labelled AGND
RB6: SJ4.1
RB7: SJ5.1
RC4: SJ1.1
RC5: SJ2.1
RESET: R128.1 SJ3.2
SCLK: C39.1 C40.1 C41.1 C42.1 IC1.25(SCLK) IC2.25(SCLK) IC3.25(SCLK) IC4.25(SCLK) IC5.9(RB1/AN10/INT1/SCK/SCL) JP85.6 TP3.P$1 TP4.P$1 TP17.P$1 TP18.P$1
SIN: IC5.1(RC7/RX/DT/SDO) R60.1 TP2.P$1
SO2: IC2.17(SOUT) R58.1 TP1.P$1 TP14.P$1
SO3: IC1.17(SOUT) R101.1 TP13.P$1 TP16.P$1
SO4: IC4.17(SOUT) R99.1 TP15.P$1 TP27.P$1
SOUT: C38.2 K1.P1(2:P) R125.2 TP28.P$1
SOUT_: IC5.8(RB0/AN12/INT0/LFT0/SDI/SDA) K1.O1(2:O) K1.S2(3:S)
VCC: C48.1 C49.1 C50.1 C51.1 C52.1 C53.1 D8.3(C) IC1.19(DCPRG) IC1.21(VCC) IC1.27(VPRG) IC2.19(DCPRG) IC2.21(VCC) IC2.27(VPRG) IC3.19(DCPRG) IC3.21(VCC) IC3.27(VPRG) IC4.19(DCPRG) IC4.21(VCC) IC4.27(VPRG) IC5.7(VDD) IC5.28(VDD) JP84.2 JP85.12 JP85.14 K1.1 L2.2 L3.2 R45.2 R46.2 R47.2 R48.2 R50.2 R51.2 R52.2 R53.2 R54.2 R55.2 R56.2 R57.2 R59.2 R61.2 R62.2 R63.2 R64.2 R65.2 R66.2 R67.2 R68.2 R69.2 R71.2 R72.2 R73.2 R74.2 R75.2 R76.2 R78.2 R79.2 R80.2 R81.2 R87.2 R88.2 R89.2 R90.2 R91.2 R92.2 R93.2 R94.2 R95.2 R96.2 R97.2 R98.2 R100.2 R102.2 R103.2 R104.2 R105.2 R106.2 R107.2 R108.2 R109.2 R110.2 R111.2 R112.2 R113.2 R114.2 R115.2 R116.2 R117.2 R118.2 R119.2 R120.2 R126.2 R129.2 TP9.P$1 TP10.P$1 TP23.P$1 TP24.P$1 ; also sheet 1,2,4
VUSB: C54.1 C55.1 IC5.37(VUSB)
XLAT: IC1.24(XLAT) IC2.24(XLAT) IC3.24(XLAT) IC4.24(XLAT) IC5.19(RA0/AN0) JP85.8 TP5.P$1 TP6.P$1 TP19.P$1 TP20.P$1
Unconnected: IC5.12(NC/ICCK/ICPGC) IC5.13(NC/ICDT/ICPGD) IC5.33(NC/!ICRST!/IVVPP) IC5.34(NC/ICPORTS) JP85.9 JP85.10 U1.ID1(USBID)

### Notes on the sheet
- 16x10k | 16x10k
- Alimentação
- Conexão USB
- 16x10k | 16x10k
- To_Pickit3
- Circuito Oscilador
- Seletores de função
- TLC5940_Motor_Drivres
- Previsto
- Reset
- Desacoplamento
- VUSB
- uProcessador
- Seletor_de_Expansão

## Sheet 4 of 4
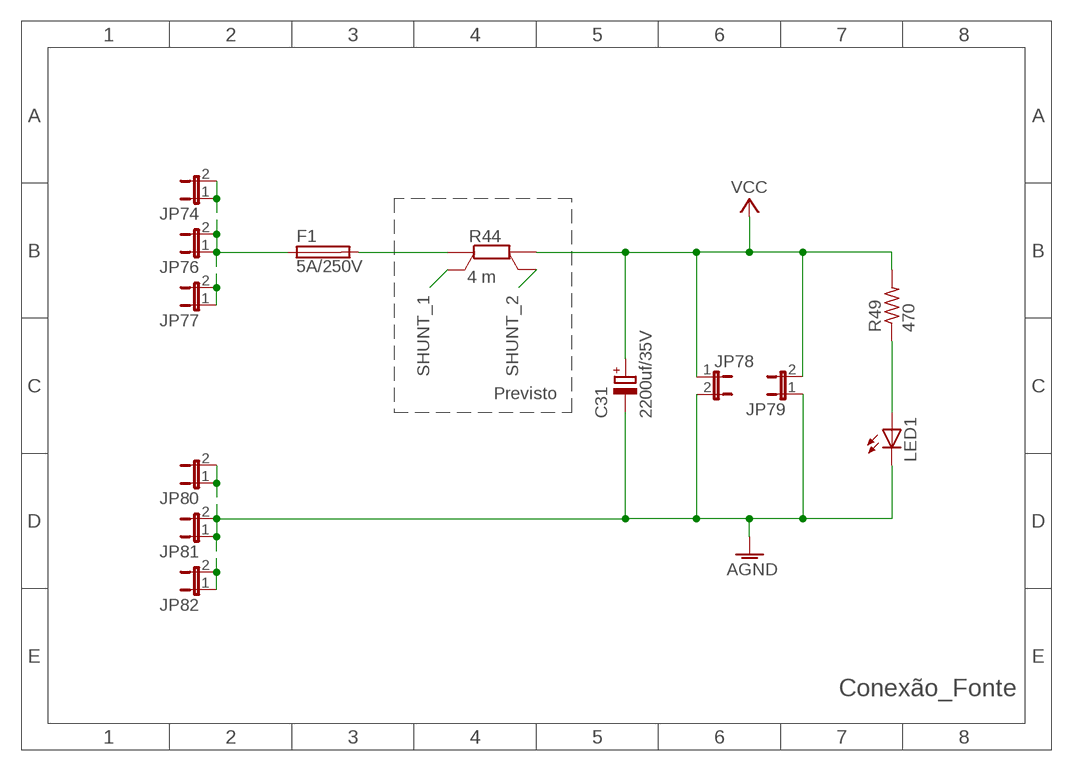
[diagram p3: schematic, sheet 4]

### Parts
C31  2200uf/35V  CPOL-EUE3.5-10  [E3,5-10]
F1  5A/250V  KS9V  [KS9V]
JP74  JP1E  [JP1]
JP76  JP1E  [JP1]
JP77  JP1E  [JP1]
JP78  JP1E  [JP1]
JP79  JP1E  [JP1]
JP80  JP1E  [JP1]
JP81  JP1E  [JP1]
JP82  JP1E  [JP1]
LED1  LED3MM  [LED3MM]
R44  4 m  PMA-B  [PMA-B]
R49  470  R-US_0613/5V  [P0613V]

### Nets
AGND: C31.- JP78.2 JP79.1 JP80.1 JP80.2 JP81.1 JP81.2 JP82.1 JP82.2 LED1.K(C) ; also sheet 1,2,3
N$170: LED1.A R49.1
N$171: F1.2 R44.B
N$172: F1.1 JP74.1 JP74.2 JP76.1 JP76.2 JP77.1 JP77.2
SHUNT_1: R44.SB
SHUNT_2: R44.SA
VCC: C31.+ JP78.1 JP79.2 R44.A R49.2 ; also sheet 1,2,3

### Notes on the sheet
- Previsto
- Conexão_Fonte

## Power pins joined to a net without a drawn wire
5V: X1.2(5V) X1.4(5V)

## Library data of the parts
C1-C5 C7-C25 C27-C30 C32-C56 = rcl:C-EU: CAPACITOR, European symbol
C6 C26 C31 = rcl:CPOL-EU: POLARIZED CAPACITOR, European symbol
D1 D4 = diode:DIODE-: DIODE
D2 D6-D8 = diode:BAS40: Silicon Schottky Diodes General-purpose diode for high-speed switching
F1 = fuse:KS9V: FUSE HOLDER CS, Schukat; OC_FARNELL: unknown; OC_NEWARK: unknown
IC1-IC4 = TLC5940:IC-PACKAGE_DIL28: Dual In Line
IC5 = microchip:PIC18F4*_TQFP: USB Microcontrollers with nanoWatt Technology High-Performance, Enhanced Flash, 28/40/44-Pin, Source: http://ww1.microchip.com/downloads/en/devicedoc/39632c.pdf; MF: MICROCHIP; MPN: PIC18F4550-I/PT; OC_FARNELL: 9321365; OC_NEWARK: 08J9633
JP1 JP10 JP20 JP21 JP74 JP76-JP82 JP84 = jumper:JP1E: JUMPER
JP2-JP9 JP12-JP19 JP22-JP37 JP40-JP55 JP58-JP73 JP83 = jumper:JP2E: JUMPER
JP11 JP75 JP86 = jumper:JP1Q: JUMPER
JP38 JP39 JP56 JP57 = jumper:JP8Q: JUMPER
JP85 = jumper:JP7Q: JUMPER
K1 = relay:4052: RELAY 2 x switch, Finder; OC_FARNELL: unknown; OC_NEWARK: unknown
L1-L3 = inductor-neosid:MS50: INDUCTOR SMD power inductor; OC_FARNELL: unknown; OC_NEWARK: unknown
LED1 = led:LED: LED OSRAM: - CHIPLED LG R971, LG N971, LY N971, LG Q971, LY Q971, LO R971, LY R971 LH N974, LH R974 LS Q976, LO Q976, LY Q976 LO Q996 - Hyper CHIPLED LW Q18S LB Q993, LB Q99A, LB R99A - SideLED LS A670, LO A670, LY A670, LG A670, LP A670 LB A673, LV A673, LT A673, LW A673 LH A674 LY A675 LS A676, LA A676, LO A676, LY A676, LW A676 LS A679, LY A679, LG A679 - Hyper Micro SIDELED® LS Y876, LA Y876, LO Y876, LY Y876 LT Y87S - SmartLED LW L88C, LW L88S LB L89C, LB L89S, LG L890 LS L89K, LO L89K, LY L89K LS L896, LA L896, LO L896, LY L896 - TOPLED LS T670, LO T670, LY T670, LG T670, LP T670 LSG T670, LSP T670, LSY T670, LOP T670, LYG T670 LG T671, LOG T671, LSG T671 LB T673, LV T673, LT T673, LW T673 LH T674 LS T676, LA T676, LO T676, LY T676, LB T676, LH T676, LSB T676, LW T676 LB T67C, LV T67C, LT T67C, LS T67K, LO T67K, LY T67K, LW E67C LS E67B, LA E67B, LO E67B, LY E67B, LB E67C, LV E67C, LT E67C LW T67C LS T679, LY T679, LG T679 LS T770, LO T770, LY T770, LG T770, LP T770 LB T773, LV T773, LT T773, LW T773 LH T774 LS E675, LA E675, LY E675, LS T675 LS T776, LA T776, LO T776, LY T776, LB T776 LHGB T686 LT T68C, LB T68C - Hyper Mini TOPLED® LB M676 - Mini TOPLED Santana® LG M470 LS M47K, LO M47K, LY M47K Source: http://www.osram.convergy.de LUXEON: - LUMILED® LXK2-PW12-R00, LXK2-PW12-S00, LXK2-PW14-U00, LXK2-PW14-V00 LXK2-PM12-R00, LXK2-PM12-S00, LXK2-PM14-U00 LXK2-PE12-Q00, LXK2-PE12-R00, LXK2-PE12-S00, LXK2-PE14-T00, LXK2-PE14-U00 LXK2-PB12-K00, LXK2-PB12-L00, LXK2-PB12-M00, LXK2-PB14-N00, LXK2-PB14-P00, LXK2-PB14-Q00 LXK2-PR12-L00, LXK2-PR12-M00, LXK2-PR14-Q00, LXK2-PR14-R00 LXK2-PD12-Q00, LXK2-PD12-R00, LXK2-PD12-S00 LXK2-PH12-R00, LXK2-PH12-S00 LXK2-PL12-P00, LXK2-PL12-Q00, LXK2-PL12-R00 Source: www.luxeon.com KINGBRIGHT: KA-3528ASYC Source: www.kingbright.com
LSP1-LSP3 = solpad:LSP10: SOLDER PAD drill 1.0 mm, distributor Buerklin, 12H555
Q1 Q5-Q7 Q10 = transistor-npn:BC817*: NPN Transistor
Q2-Q4 = transistor-pnp:BC807*: PNP Transistror
R1-R43 R58 R60 R70 R77 R86 R99 R101 R125-R128 R130-R133 = rcl:R-EU_: RESISTOR, European symbol
R44 = resistor-shunt:PMA-B: SMD SHUNT RESISTOR; OC_FARNELL: unknown; OC_NEWARK: unknown
R45-R57 R59 R61-R69 R71-R76 R78-R85 R87-R98 R100 R102-R124 R129 = rcl:R-US_: RESISTOR, American symbol
S1-S14 = SparkFun-Electromechanical:TAC_SWITCH: Momentary Switch Button commonly used for reset or general input. Spark Fun Electronics SKU : COM-00097 SMT- SWCH-08247
SG1 = buzzer:F/CM12P: BUZZER Source: Buerklin; OC_FARNELL: unknown; OC_NEWARK: unknown
SJ1 SJ2 SJ4 SJ5 = SparkFun-Passives:JUMPER-PAD-3-2OF3_NC_BY_PASTE
SJ3 = SparkFun-Passives:JUMPER-PAD-2-NO
TP1-TP28 = SparkFun-Passives:TEST-POINT: Bare copper test points for troubleshooting or ICT
U1 = SparkFun-Connectors:USB-AB: This is a USB AB connector that is compatible with USB OTG. i.e. this connector can serve as a host or device; PROD_ID: CONN-11794
X1 = SparkFun-Boards:RASPBERRYPI-B+-GPIO: Raspberry Pi B+ GPIO Header 2x20 pin connector
XT1 = crystal:CRYSTAL: CRYSTAL; OC_FARNELL: unknown; OC_NEWARK: unknown
XT2 = crystal:CRYSTAL: CRYSTAL; OC_FARNELL: 1666969; OC_NEWARK: unknown
Z1 Z2 = diode:BAS70: Silicon Schottky Diodes General-purpose diode for high-speed switching